# Altium schematic sheet MIXR UI - Buttons.SchDoc: Title
size B; Organization: Midnight Sun Solar Rayce Car Team; Address1: University of Waterloo; Address2: 200 University Ave W; Address3: Waterloo, ON, Canada; Address4: N2L 3E9; DocumentNumber: 14; SheetNumber: 14; SheetTotal: 14; Website: www.uwmidsun.com; ProjectName: ProjectName
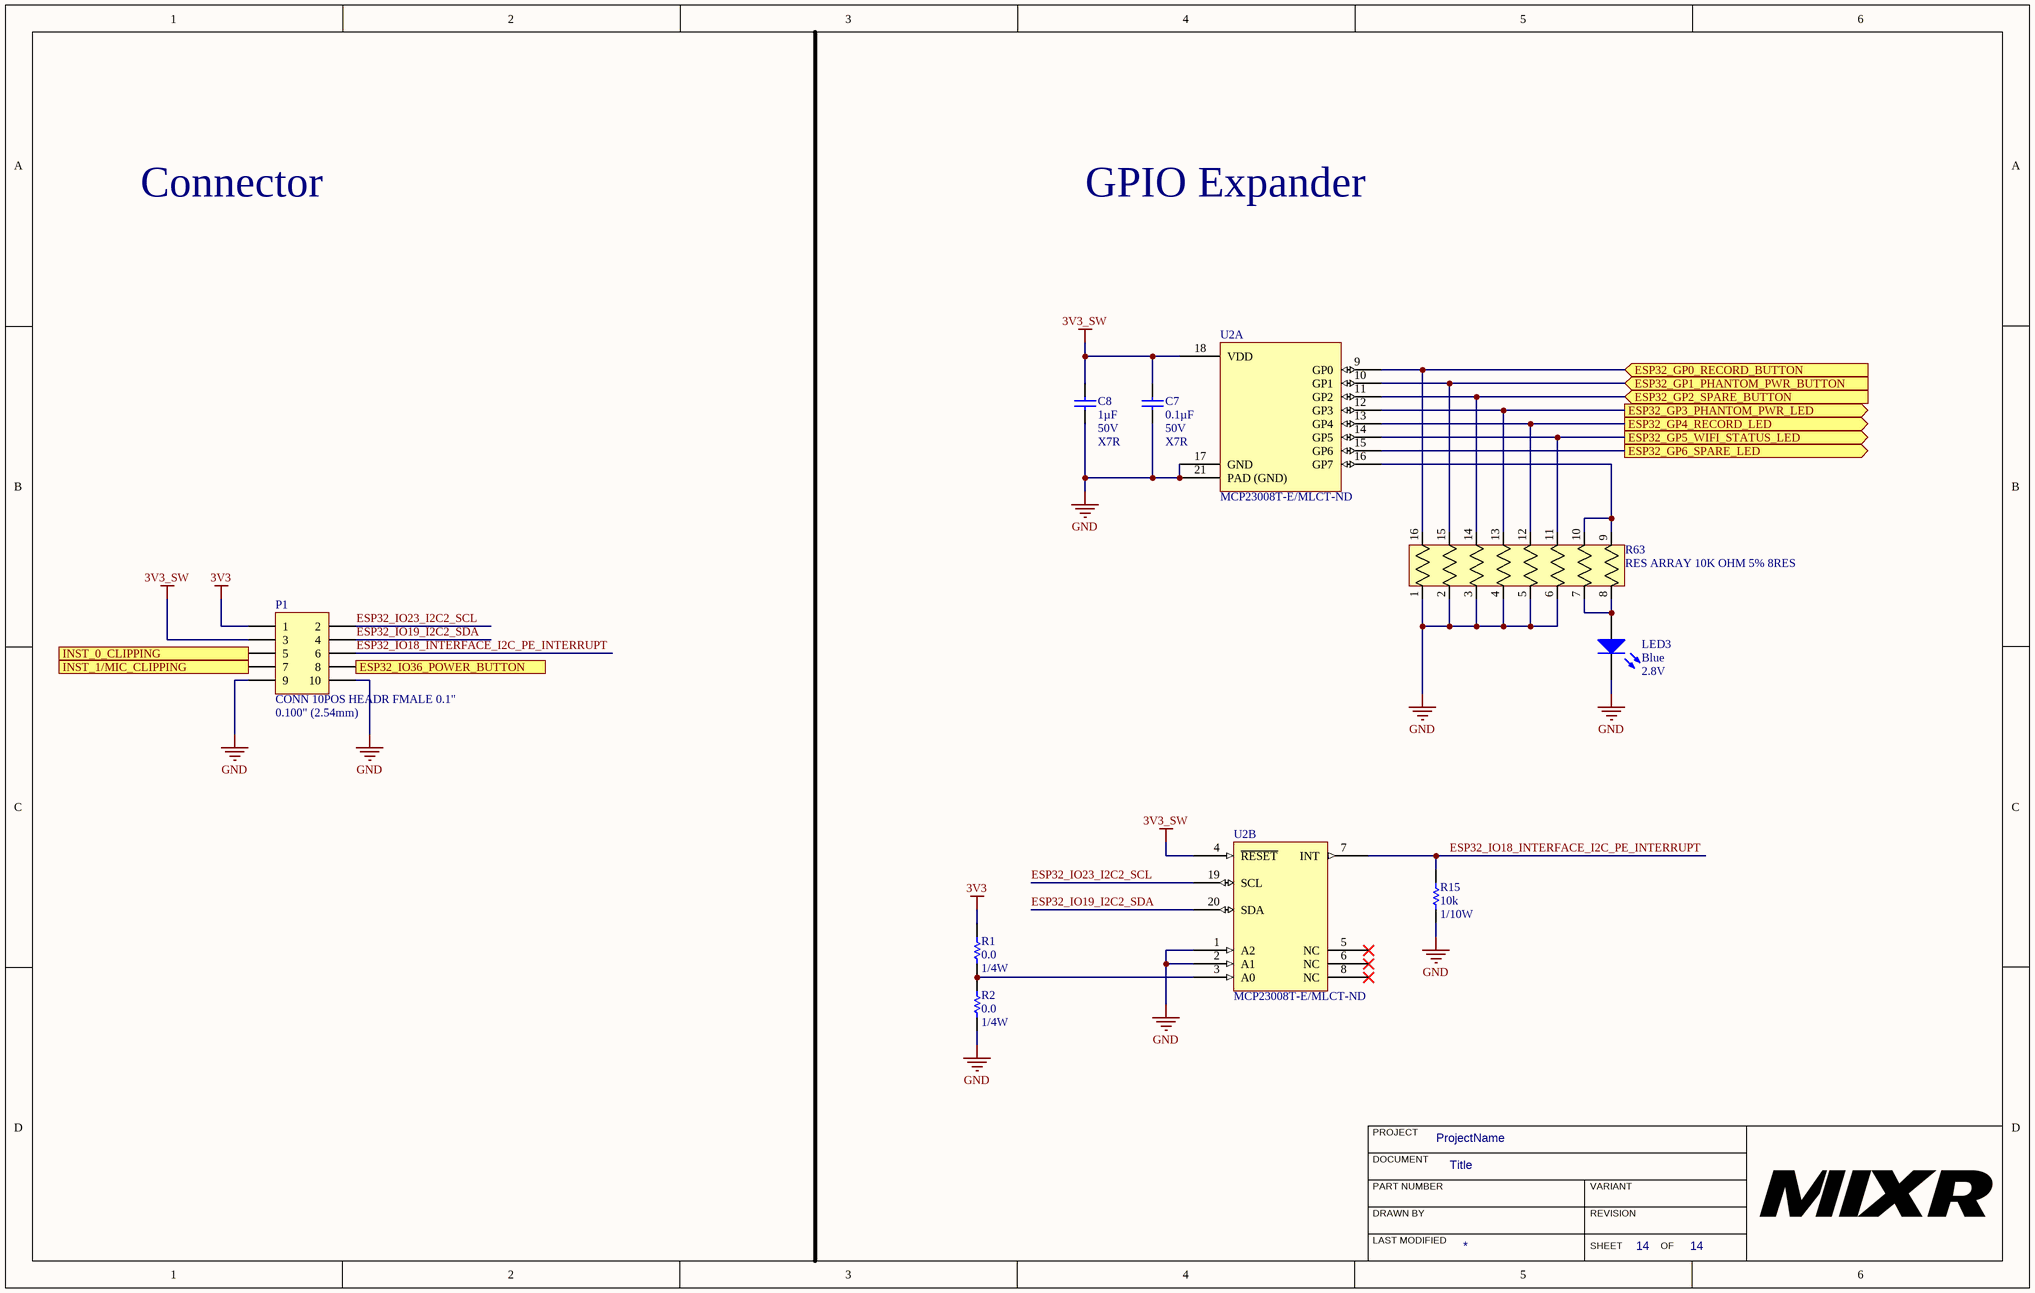
[diagram p0: MIXR UI - Buttons.SchDoc]

## Parts
C7  Capacitance: 0.1µF  Voltage: 50V  Temperature Coefficient: X7R  [CAP, 0603]  (hidden comment: CAP CER 0.1UF 50V 10% X7R 0603)
C8  Capacitance: 1µF  Voltage: 50V  Temperature Coefficient: X7R  [CAP, 0603]  (hidden comment: CAP CER 1UF 50V 10% X7R 0603)
LED3  Color: Blue  Voltage - Forward (Vf) (Typ): 2.8V  [LED_0603]  (hidden comment: LED BLUE CLEAR 2.8V 0603)
P1  CONN 10POS HEADR FMALE 0.1"  Pitch - Mating: 0.100" (2.54mm)  [CONN ,10 POS Header 0.100"]
R1  Resistance: 0.0  Power (Watts): 1/4W  [RES, 0603]  (hidden comment: RES 0.0 OHM 1/4W 0603)
R2  Resistance: 0.0  Power (Watts): 1/4W  [RES, 0603]  (hidden comment: RES 0.0 OHM 1/4W 0603)
R15  Resistance: 10k  Power: 1/10W  [RES, 0603]  (hidden comment: RES 10K OHM 1% 1/10W 0603)
R63  RES ARRAY 10K OHM 5% 8RES  [RES ARRAY, 8 POS 1506]
U2  Supplier Part Number 1: MCP23008T-E/MLCT-ND  [QFN50P400X400X100_HS-21M]  (hidden comment: MCP23008)  (parts A,B of 2)

## Ports
ESP32_GP0_RECORD_BUTTON (in), ESP32_GP1_PHANTOM_PWR_BUTTON (in), ESP32_GP2_SPARE_BUTTON (in), ESP32_GP3_PHANTOM_PWR_LED (out), ESP32_GP4_RECORD_LED (out), ESP32_GP5_WIFI_STATUS_LED (out), ESP32_GP6_SPARE_LED (out), ESP32_IO36_POWER_BUTTON (in), INST_0_CLIPPING (out), INST_1/MIC_CLIPPING (out)

## Nets
3V3: P1.1 R1.1
3V3_SW: C7.1 C8.1 P1.3 U2.4(~{RESET}) U2.18(VDD)
GND: C7.2 C8.2 LED3.2(K) P1.9 P1.10 R2.2 R15.2 R63.1 R63.2 R63.3 R63.4 R63.5 R63.6 U2.1(A2) U2.2(A1) U2.17(GND) U2.21(PAD_(GND))
ESP32_GP0_RECORD_BUTTON: R63.16 U2.9(GP0) ; port ESP32_GP0_RECORD_BUTTON
ESP32_GP1_PHANTOM_PWR_BUTTON: R63.15 U2.10(GP1) ; port ESP32_GP1_PHANTOM_PWR_BUTTON
ESP32_GP2_SPARE_BUTTON: R63.14 U2.11(GP2) ; port ESP32_GP2_SPARE_BUTTON
ESP32_GP3_PHANTOM_PWR_LED: R63.13 U2.12(GP3) ; port ESP32_GP3_PHANTOM_PWR_LED
ESP32_GP4_RECORD_LED: R63.12 U2.13(GP4) ; port ESP32_GP4_RECORD_LED
ESP32_GP5_WIFI_STATUS_LED: R63.11 U2.14(GP5) ; port ESP32_GP5_WIFI_STATUS_LED
ESP32_GP6_SPARE_LED: U2.15(GP6) ; port ESP32_GP6_SPARE_LED
ESP32_IO18_INTERFACE_I2C_PE_INTERRUPT: P1.6 R15.1 U2.7(INT)
ESP32_IO19_I2C2_SDA: P1.4 U2.20(SDA)
ESP32_IO23_I2C2_SCL: P1.2 U2.19(SCL)
ESP32_IO36_POWER_BUTTON: P1.8 ; port ESP32_IO36_POWER_BUTTON
INST_0_CLIPPING: P1.5 ; port INST_0_CLIPPING
INST_1/MIC_CLIPPING: P1.7 ; port INST_1/MIC_CLIPPING
NetLED3_1: LED3.1(A) R63.7 R63.8
NetR1_2: R1.2 R2.1 U2.3(A0)
NetR63_9: R63.9 R63.10 U2.16(GP7)

Not connected (* = marked no-connect by the designer): U2 5(NC)* 6(NC)* 8(NC)*

## Notes on the sheet
- Connector
- GPIO Expander
- PROJECT
- DOCUMENT
- DRAWN BY
- LAST MODIFIED
- PART NUMBER
- REVISION
- SHEET
- VARIANT
- OF

## Library data of the parts
C7 = CAP CER 0.1UF 50V 10% X7R 0603: 0.10µF ±10% 50V Ceramic Capacitor X7R 0603 (1608 Metric); Manufacturer 1: AVX Corporation; Manufacturer Part Number 1: 06035C104KAT2A; Supplier 1: Digi-Key; Supplier Part Number 1: 478-5052-1-ND; Packaging: Cut Tape (CT); Part Status: Active; Operating Temperature: -55°C ~ 125°C; Ratings: -; Mounting Type: Surface Mount, MLCC; Package / Case: 0603 (1608 Metric); Size / Dimension: 0.063" L x 0.032" W (1.60mm x 0.81mm); Height - Seated (Max): -; Thickness (Max): 0.035" (0.90mm); Lead Spacing: -; Lead Style: -; ComponentLink1URL: http://datasheets.avx.com/X7RDielectric.pdf; ComponentLink1Description: http://datasheets.avx.com/X7RDielectric.pdf; Tolerance: ±10%
C8 = CAP CER 1UF 50V 10% X7R 0603: 1µF ±10% 50V Ceramic Capacitor X7R 0603 (1608 Metric); Manufacturer 1: Taiyo Yuden; Manufacturer Part Number 1: UMK107AB7105KA-T; Supplier 1: Digi-Key; Supplier Part Number 1: 587-3247-1-ND; Packaging: Cut Tape (CT); Part Status: Active; Operating Temperature: -55°C ~ 125°C; Ratings: -; Mounting Type: Surface Mount, MLCC; Package / Case: 0603 (1608 Metric); Size / Dimension: 0.063" L x 0.031" W (1.60mm x 0.80mm); Height - Seated (Max): -; Thickness (Max): 0.037" (0.95mm); Lead Spacing: -; Lead Style: -; ComponentLink1URL: http://www.yuden.co.jp/productdata/catalog/en/mlcc_all_e.pdf; ComponentLink1Description: http://www.yuden.co.jp/productdata/catalog/en/mlcc_all_e.pdf; Tolerance: ±10%
LED3 = LED BLUE CLEAR 2.8V 0603: Blue 470nm LED Indication - Discrete 2.8V 0603 (1608 Metric); Manufacturer 1: Lite-On Inc.; Manufacturer Part Number 1: LTST-C193TBKT-5A; Lens Color: Colorless; Millicandela Rating: 15mcd; Lens Style/Size: Rectangle with Flat Top, 1.15mm x 0.80mm; Current - Test: 5mA; Viewing Angle: 130°; Wavelength - Peak: 468nm; Supplier 1: Digi-Key; Supplier Part Number 1: 160-1827-1-ND; Packaging: Cut Tape (CT); Part Status: Active; Lens Transparency: Clear; Mounting Type: Surface Mount; Wavelength - Dominant: 470nm; Package / Case: 0603 (1608 Metric); Supplier Device Package: Chip LED; Size / Dimension: 1.60mm L x 0.80mm W; Height (Max): 0.45mm; ComponentLink1URL: http://optoelectronics.liteon.com/upload/download/DS22-2004-060/P_100_LTST-C193TBKT-5A.pdf; ComponentLink1Description: http://optoelectronics.liteon.com/upload/download/DS22-2004-060/P_100_LTST-C193TBKT-5A.pdf
P1 = CONN 10POS HEADR FMALE 0.1": 10 Position Header Connector 0.100" (2.54mm) Through Hole, Right Angle Gold; Manufacturer 1: Sullins Connector Solutions; Manufacturer Part Number 1: SFH11-PBPC-D05-RA-BK; Style: Board to Board; Number of Positions: 10; Number of Positions Loaded: All; Contact Length - Post: 0.106" (2.69mm); Material Flammability Rating: UL94 V-0; Current Rating: 3A; Supplier 1: Digi-Key; Supplier Part Number 1: S9202-ND; Packaging: Tray; Part Status: Active; Connector Type: Header; Contact Type: Female Socket; Number of Rows: 2; Row Spacing - Mating: 0.100" (2.54mm); Mounting Type: Through Hole, Right Angle; Termination: Solder; Fastening Type: Push-Pull; Contact Finish - Mating: Gold; Contact Finish Thickness - Mating: Flash; Insulation Color: Black; Insulation Height: 0.236" (6.00mm); Operating Temperature: -40°C ~ 105°C; Contact Finish - Post: Gold; Mated Stacking Heights: -; Ingress Protection: -; Insulation Material: Polybutylene Terephthalate (PBT); Contact Shape: Square; Contact Material: Brass; Contact Finish Thickness - Post: Flash; ComponentLink1URL: http://sullinscorp.com/catalogs/147_PAGE119_.100_SFH11_SERIES_FEMALE_HDR_ST_RA.pdf; ComponentLink1Description: http://sullinscorp.com/catalogs/147_PAGE119_.100_SFH11_SERIES_FEMALE_HDR_ST_RA.pdf; Voltage: -
R1 R2 = RES 0.0 OHM 1/4W 0603: RES SMD 0.0 OHM JUMPER 1/4W 0603; Manufacturer 1: Vishay Dale; Manufacturer Part Number 1: CRCW06030000Z0EAHP; Supplier 1: Digi-Key; Supplier Part Number 1: 541-0.0SBCT-ND; Packaging: Cut Tape (CT); Part Status: Active; Composition: Thick Film; Operating Temperature: -55°C ~ 155°C; Package / Case: 0603 (1608 Metric); Supplier Device Package: 0603; Size / Dimension: 0.063" L x 0.033" W (1.60mm x 0.85mm); Height - Seated (Max): 0.022" (0.55mm); Failure Rate: -; ComponentLink1URL: http://www.vishay.com/docs/20043/crcwhpe3.pdf; ComponentLink1Description: http://www.vishay.com/docs/20043/crcwhpe3.pdf
R15 = RES 10K OHM 1% 1/10W 0603: RES SMD 10K OHM 1% 1/10W 0603; Manufacturer 1: Yageo; Manufacturer Part Number 1: RC0603FR-0710KL; Temperature Coefficient: ±100ppm/°C; Supplier 1: Digi-Key; Supplier Part Number 1: 311-10.0KHRCT-ND; Packaging: Cut Tape (CT); Part Status: Active; Composition: Thick Film; Operating Temperature: -55°C ~ 155°C; Package / Case: 0603 (1608 Metric); Supplier Device Package: 0603; Size / Dimension: 0.063" L x 0.031" W (1.60mm x 0.80mm); Height - Seated (Max): 0.022" (0.55mm); Failure Rate: -; ComponentLink1URL: http://www.yageo.com/documents/recent/PYu-RC_Group_51_RoHS_L_7.pdf; ComponentLink1Description: http://www.yageo.com/documents/recent/PYu-RC_Group_51_RoHS_L_7.pdf; Tolerance: ±1%
R63 = RES ARRAY 10K OHM 5% 8RES EXB-2HV103JV: RES ARRAY SMD 10K 5% 62.5mW 1506; Manufacturer: Panasonic Electronic Components; Vendor: Panasonic; C: Copyright (C) 2015 Accelerated Designs. All rights reserved; Circuit Type: Isolated; Temperature Coefficient: ±200ppm/°C; Value: Value; Copyright: Copyright (C) 2015 Accelerated Designs. All rights reserved; Manufacturer_Part_Number: EXB-2HV103JV; Supplier 1: Digi-Key; Manufacturer Part Number: EXB-2HV103JV; RoHS: RoHS Compliant; Category: Resistors; Stock 1: 152779; Pricing 1: 1=0.43, 10=0.373, 25=0.2712, 50=0.1964, 100=0.1456, 250=0.11176, 500=0.08806, 1000=0.06096 (CAD); Packaging: Cut Tape (CT); Part Status: Active; Resistance (Ohms): 10k; Tolerance: ±5%; Power Per Element: 62.5mW; Operating Temperature: -55°C ~ 125°C; Applications: Automotive AEC-Q200; Mounting Type: Surface Mount; Package / Case: 1506, Convex, Long Side Terminals; Supplier Device Package: 1506; Size / Dimension: 0.150" L x 0.063" W (3.80mm x 1.60mm); Height - Seated (Max): 0.022" (0.55mm); ComponentLink1URL: https://industrial.panasonic.com/cdbs/www-data/pdf/AOC0000/AOC0000C14.pdf; ComponentLink1Description: https://industrial.panasonic.com/cdbs/www-data/pdf/AOC0000/AOC0000C14.pdf; Supplier Part Number 1: Y1103CT-ND
U2 = IC I/O EXPANDER I2C 8CH 20 QFN: I/O Expander 8 I²C 1.7MHz 20-QFN-EP (4x4) /; Manufacturer 1: Microchip; Manufacturer Part Number 1: MCP23008T-E/ML; Interface: I2C,Serial; Number of I/Os: 8; Power Dissipation: 700mW; Operating Supply Voltage: 5.5V; ComponentLink1URL: http://www.microchip.com/mymicrochip/filehandler.aspx?ddocname=en021920; ComponentLink1Description: http://www.microchip.com/mymicrochip/filehandler.aspx?ddocname=en021920; Supplier 1: Digi-Key; Stock 1: 3994; Pricing 1: 1=1.10000, 25=0.92000, 100=0.84000 (USD); RoHS: Yes; Case/Package: QFN; Min Operating Temperature: -40°C; Max Operating Temperature: 125°C; Packaging: Tape and Reel; Package Quantity: 3300; Frequency: 1.7MHz; Max Frequency: 1.7MHz; Lead Free: Lead Free; ComponentLink2URL: https://datasheet.ciiva.com/16617/21919e-16617627.pdf?src-supplier=Avnet+Europe; ComponentLink2Description: https://datasheet.ciiva.com/16617/21919e-16617627.pdf?src-supplier=Avnet+Europe; ComponentLink3URL: https://datasheet.ciiva.com/12267/21919e-12267580.pdf?src-supplier=Mouser; ComponentLink3Description: https://datasheet.ciiva.com/12267/21919e-12267580.pdf?src-supplier=Mouser; ComponentLink4URL: https://datasheet.ciiva.com/8128/21919e-8128685.pdf?src-supplier=Avnet; ComponentLink4Description: https://datasheet.ciiva.com/8128/21919e-8128685.pdf?src-supplier=Avnet